# Altium schematic sheet SchR1_Propu.SchDoc
size A4
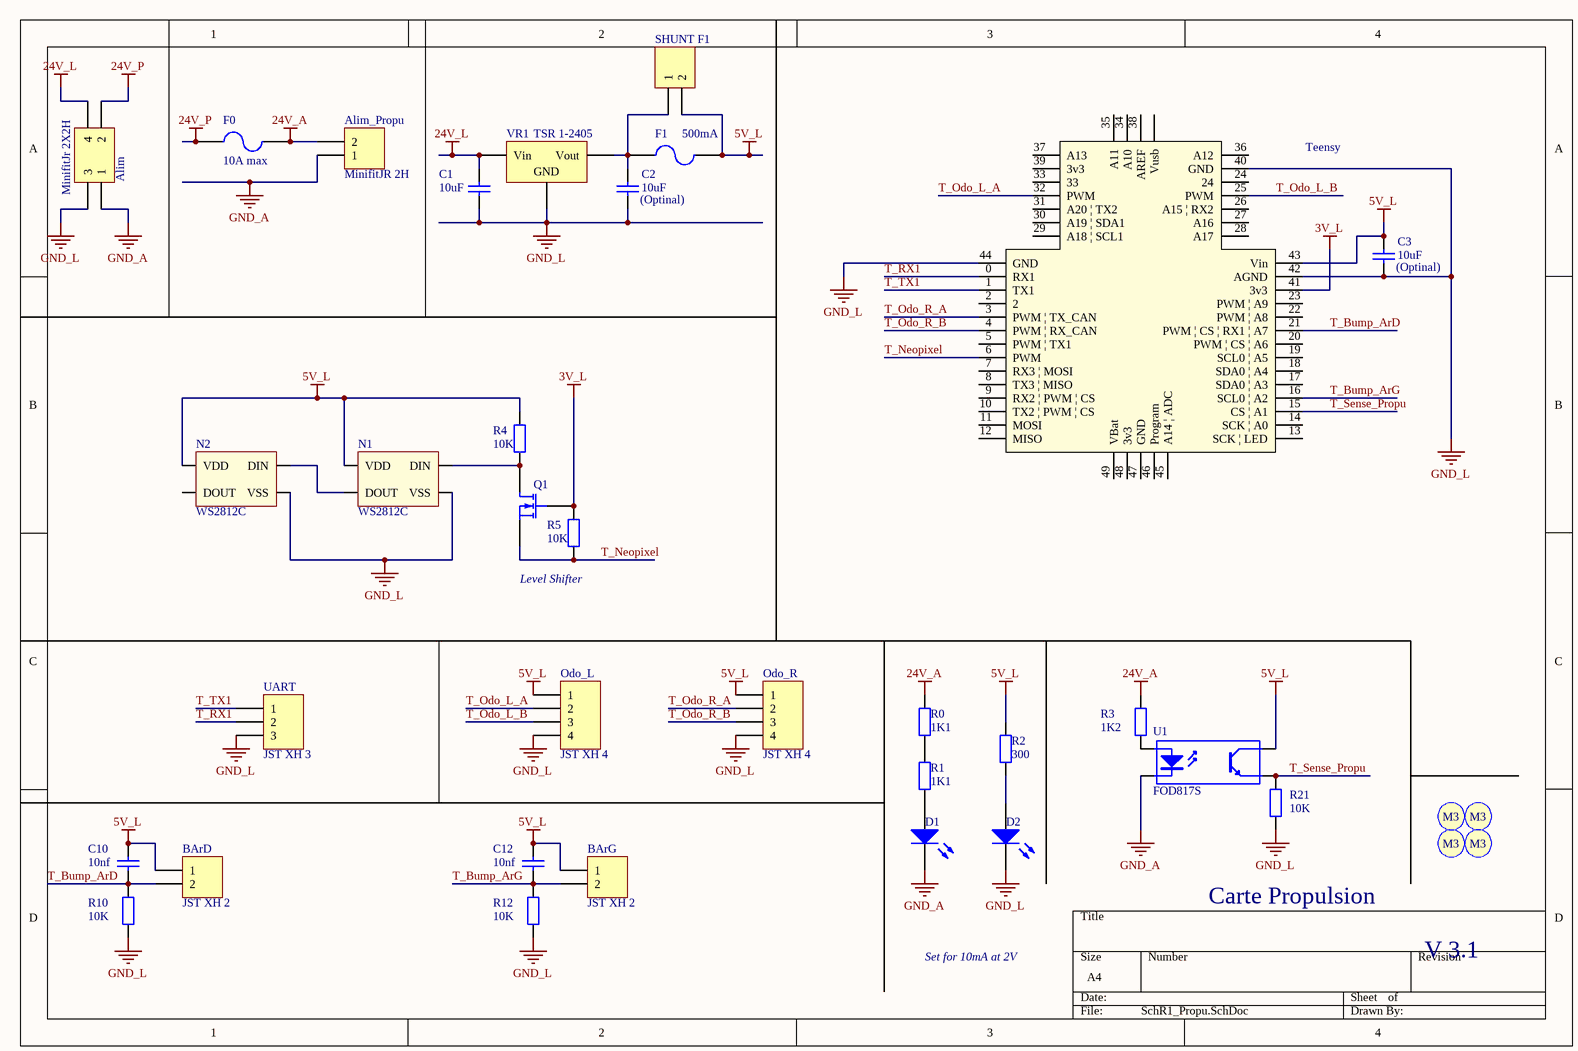
[diagram p0: SchR1_Propu.SchDoc]

## Parts
Alim  MinifitJr 2X2H  [MOLEX_MINIFITJR_2X2H]
Alim_Propu  MinifitJR 2H  [Molex_MiniFitJr_2x1H]
BArD  JST XH 2  [S2B-XH-A]
BArG  JST XH 2  [S2B-XH-A]
C1  value 10uF  [Capacitor 1206]
C2  (Optinal)  value 10uF  [Capacitor 1206]
C3  (Optinal)  value 10uF  [Capacitor 1206]
C10  value 10nf  [Capacitor 1206]  (hidden comment: Cap)
C12  value 10nf  [Capacitor 1206]  (hidden comment: Cap)
D1  A  [KP-3216SEC]  (value not drawn)
D2  L  [KP-3216SEC]  (value not drawn)
F0  10A max  [Fuse]
F1  500mA  [3.5X2.8X1.9]
N1  WS2812C  [Neopixel]
N2  WS2812C  [Neopixel]
Odo_L  JST XH 4  [S4B-XH-A]
Odo_R  JST XH 4  [S4B-XH-A]
Q1  MOSFET-N  [SOT23_M]  (value not drawn)
R0  value 1K1  [Resistor 1206]  (hidden comment: Res2)
R1  value 1K1  [Resistor 1206]  (hidden comment: Res2)
R2  value 300  [Resistor 1206]  (hidden comment: Res2)
R3  value 1K2  [Resistor 1206]  (hidden comment: Res2)
R4  value 10K  [Resistor 1206]  (hidden comment: Res2)
R5  value 10K  [Resistor 1206]  (hidden comment: Res2)
R10  value 10K  [Resistor 1206]  (hidden comment: Res2)
R12  value 10K  [Resistor 1206]  (hidden comment: Res2)
R21  value 10K  [Resistor 1206]  (hidden comment: Res2)
S1  Screw M3  [Screw M3]  (value not drawn)
S2  Screw M3  [Screw M3]  (value not drawn)
S3  Screw M3  [Screw M3]  (value not drawn)
S4  Screw M3  [Screw M3]  (value not drawn)
SHUNT_F1  Header 2  [HDR1X2]  (value not drawn)
Teensy  Teensy 3.2  [teensy]  (value not drawn)
U1  FOD817S  [SOP254P1016X385-4N]
UART  JST XH 3  [HDR1X3H]
VR1  TSR 1-2405  [TRS]

## Nets
3V_L: Q1.2(G) R5.2 Teensy.41(3v3)
5V_L: BArD.1 BArG.1 C3.2 C10.2 C12.2 F1.2 N1.1(VDD) N2.1(VDD) Odo_L.1 Odo_R.1 R2.1 R4.2 SHUNT_F1.2 Teensy.43(Vin) U1.4(C)
24V_A: Alim_Propu.2 F0.2 R0.1 R3.2
24V_L: Alim.4 C1.2 VR1.1(Vin)
24V_P: Alim.2 F0.1
GND_A: Alim.1 Alim_Propu.1 D1.2(K) U1.2(K)
GND_L: Alim.3 C1.1 C2.1 C3.1 D2.2(K) N1.3(VSS) N2.3(VSS) Odo_L.4 Odo_R.4 R10.2 R12.2 R21.1 Teensy.40(GND) Teensy.42(AGND) Teensy.44(GND) UART.3 VR1.2(GND)
T_Bump_ArD: BArD.2 C10.1 R10.1 Teensy.21(PWM_|_CS_|_RX1_|_A7)
T_Bump_ArG: BArG.2 C12.1 R12.1 Teensy.16(SCL0_|_A2)
T_Neopixel: Q1.3(S) R5.1 Teensy.6(PWM)
T_Odo_L_A: Odo_L.2 Teensy.32(PWM)
T_Odo_L_B: Odo_L.3 Teensy.25(PWM)
T_Odo_R_A: Odo_R.2 Teensy.3(PWM_|_TX_CAN)
T_Odo_R_B: Odo_R.3 Teensy.4(PWM_|_RX_CAN)
T_RX1: Teensy.0(RX1) UART.2
T_Sense_Propu: R21.2 Teensy.15(CS_|_A1) U1.3(E)
T_TX1: Teensy.1(TX1) UART.1
NetC2_2: C2.2 F1.1 SHUNT_F1.1 VR1.3(Vout)
NetD1_1: D1.1(A) R1.2
NetD2_1: D2.1(A) R2.2
NetN1_2: N1.2(DOUT) N2.4(DIN)
NetN1_4: N1.4(DIN) Q1.1(D) R4.1
NetR0_2: R0.2 R1.1
NetR3_1: R3.1 U1.1(A)

Not connected (* = marked no-connect by the designer): N2 2(DOUT); Teensy 2 5(PWM_|_TX1) 7(RX3_|_MOSI) 8(TX3_|_MISO) 9(RX2_|_PWM_|_CS) 10(TX2_|_PWM_|_CS) 11(MOSI) 12(MISO) 13(SCK_|_LED) 14(SCK_|_A0) 17(SDA0_|_A3) 18(SDA0_|_A4) 19(SCL0_|_A5) 20(PWM_|_CS_|_A6) 22(PWM_|_A8) 23(PWM_|_A9) 24 26(A15_|_RX2) 27(A16) 28(A17) 29(A18_|_SCL1) 30(A19_|_SDA1) 31(A20_|_TX2) 33 34(A10) 35(A11) 36(A12) 37(A13) 38(AREF) 39(3v3) 45(A14_|_ADC) 46(Program) 47(GND) 48(3v3) 49(VBat) 50(Vusb)

## Notes on the sheet
- (near R5) Level Shifter
- Carte Propulsion
- Set for 10mA at 2V
- V 3.1
- (in symbol Screw M3) M3

## Library data of the parts
Alim = Header 2X2H: Header, 2-Pin, Dual row, Right Angle; LatestRevisionDate: 17-Jul-2002; LatestRevisionNote: Re-released for DXP Platform.; Publisher: Altium Limited
Alim_Propu BArD BArG SHUNT_F1 = Header 2: Header, 2-Pin; LatestRevisionDate: 17-Jul-2002; LatestRevisionNote: Re-released for DXP Platform.; Publisher: Altium Limited
C1-C3 C10 C12 = Cap: Capacitor; Published: 8-Jun-2000; LatestRevisionDate: 17-Jul-2002; LatestRevisionNote: Re-released for DXP Platform.; PackageReference: RAD-0.3; Publisher: Altium Limited; PackageDescription: Radial Cap, Thru-Hole; 2 Leads; 0.3 in Pin Spacing
D1 D2 = LED2: Typical RED, GREEN, YELLOW, AMBER GaAs LED; Published: 8-Jun-2000; LatestRevisionDate: 17-Jul-2002; LatestRevisionNote: Re-released for DXP Platform.; PackageVersion: Feb-2002; PackageReference: 3.2X1.6X1.1; Publisher: Altium Limited; PackageDescription: SM LED; 2 Flat Leads
F0 = Fuse 2: Main Fuse; Published: 8-Jun-2000; LatestRevisionDate: 17-Jul-2002; LatestRevisionNote: Re-released for DXP Platform.; PackageReference: PIN-W2/E2.8; Publisher: Altium Limited; PackageDescription: Thru-Hole; 2 Leads
F1 = Fuse 2: Fuse; Published: 8-Jun-2000; LatestRevisionDate: 17-Jul-2002; LatestRevisionNote: Re-released for DXP Platform.; PackageReference: PIN-W2/E2.8; Publisher: Altium Limited; PackageDescription: Thru-Hole; 2 Leads
N1 N2 = WS2812C: Intelligent control LED; pin to pad: 1>4 2>1 3>2 4>3
Odo_L Odo_R = Header 4H: Molex SPOX 4x1H; LatestRevisionDate: 17-Jul-2002; LatestRevisionNote: Re-released for DXP Platform.; Publisher: Altium Limited
Q1 = MOSFET-N: N-Channel MOSFET; pin to pad: 2>3 3>2; Published: 8-Jun-2000; LatestRevisionDate: 17-Jul-2002; LatestRevisionNote: Re-released for DXP Platform.; PackageVersion: 1995/1996; PackageReference: E3; Publisher: Altium Limited; PackageDescription: TO, Flat Index; 3 In-Line, Axial Leads; Body Dia. 4.6mm; Lead Dia. 0.5 mm (max)
R0-R5 R10 R12 R21 = Res2: Resistor; Published: 8-Jun-2000; LatestRevisionDate: 17-Jul-2002; LatestRevisionNote: Re-released for DXP Platform.; PackageReference: AXIAL-0.4; Publisher: Altium Limited; PackageDescription: Axial Device, Thru-Hole; 2 Leads; 0.4 in Pin Spacing
Teensy = teensy3.2
U1 = Optoisolator1: 4-Pin Phototransistor Optocoupler; Published: 24-Mar-1999; LatestRevisionDate: 04-Mar-2005; LatestRevisionNote: Sch pins 3 & 4 Swapped.; DatasheetVersion: Nov-2003; PackageReference: DIP-4; Publisher: Altium Limited
UART = Header 3H: Header, 3-Pin, Right Angle; LatestRevisionDate: 17-Jul-2002; LatestRevisionNote: Re-released for DXP Platform.; Publisher: Altium Limited
VR1 = Volt Reg: Voltage Regulator; Published: 24-Mar-1999; LatestRevisionDate: 29-May-2009; LatestRevisionNote: IPC-7351 Footprint Added.; PackageReference: D2PAK; Publisher: Altium Limited; PackageDescription: 3-Pin Transistor Outline Package 2.54 mm Pitch, 15.1 mm Lead Span